# Altium schematic sheet 9-MIPI.SchDoc
size 431 x 279 mm; Organization: ORGANIZATION; Address1: ADDRESS 1; Address2: ADDRESS 2; Address3: ADDRESS 3; Address4: ADDRESS 4; DocumentNumber: 9; Revision: -; SheetNumber: 9; SheetTotal: 14; ENG_APP_DATE: --/--/--; DSN_APP_DATE: --/--/--; CHK_APP_DATE: --/--/--
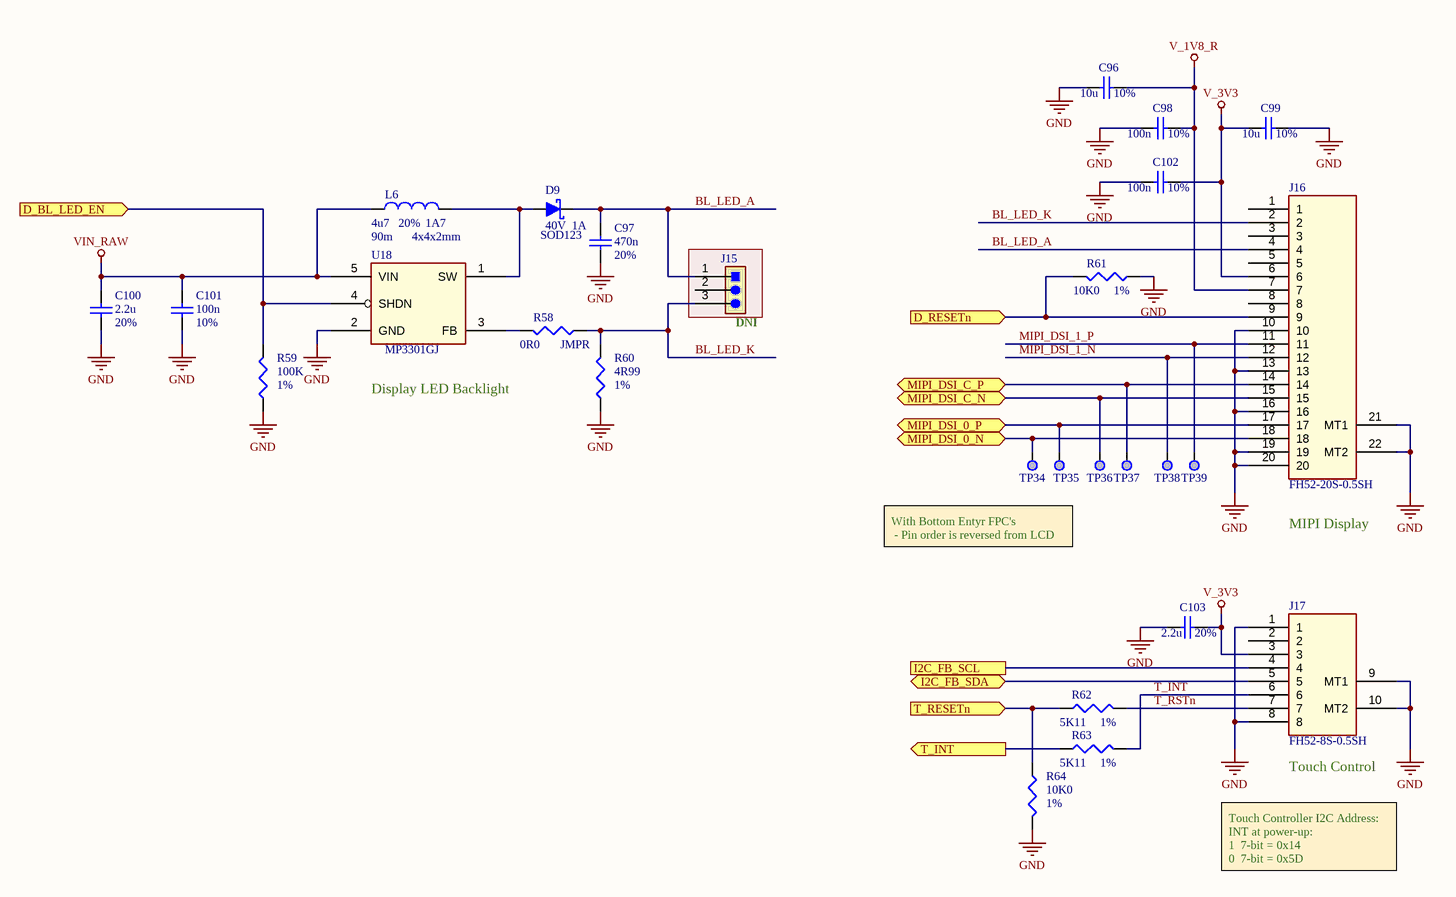
[diagram p0: 9-MIPI.SchDoc]

## Parts
C96  value 10u  Tolerance: 10%  [CAPC0402-01]  (hidden comment: Cap)
C97  value 470n  Tolerance: 20%  [CAPC0402-01]  (hidden comment: Cap)
C98  value 100n  Tolerance: 10%  [CAPC0402-01]  (hidden comment: Cap)
C99  value 10u  Tolerance: 10%  [CAPC0402-01]  (hidden comment: Cap)
C100  value 2.2u  Tolerance: 20%  [CAPC0402-01]  (hidden comment: Cap_225M25VX5R0402_1)
C101  value 100n  Tolerance: 10%  [CAPC0402-01]  (hidden comment: Cap)
C102  value 100n  Tolerance: 10%  [CAPC0402-01]  (hidden comment: Cap)
C103  value 2.2u  Tolerance: 20%  [CAPC0402-01]  (hidden comment: Cap_225M25VX5R0402_1)
D9  value 40V  1A  PackageDescription: SOD123  [SOD123F_NXP]  (hidden comment: D Schottky)
J15  TSW-103-07-G-S  [CONN_HDR_1X3_STRT_0.100_no3D]  (value not drawn)
J16  FH52-20S-0.5SH  [CONN_FPC_BOT-ENT_FRONT-LOCK_0.50_20_reversed]
J17  FH52-8S-0.5SH  [CONN_FPC_BOT-ENT_FRONT-LOCK_0.50_8_reversed]
L6  value 4u7  PackageDescription: 4x4x2mm  DCR: 90m  RMS_Current: 1A7  Tolerance: 20%  [IND_IFSC_1515AH_VIS-M]  (hidden comment: Inductor)
R58  value 0R0  Tolerance: JMPR  [RESC0402-01]  (hidden comment: Res3)
R59  value 100K  Tolerance: 1%  [RESC0402-01]  (hidden comment: Res3)
R60  value 4R99  Tolerance: 1%  [RESC0402-01]  (hidden comment: Res3)
R61  value 10K0  Tolerance: 1%  [RESC0402-01]  (hidden comment: Res3)
R62  value 5K11  Tolerance: 1%  [RESC0402-01]  (hidden comment: Res3)
R63  value 5K11  Tolerance: 1%  [RESC0402-01]  (hidden comment: Res3)
R64  value 10K0  Tolerance: 1%  [RESC0402-01]  (hidden comment: Res3)
TP34  TP_SMPAD  [TP_30_RND]  (value not drawn)  (no BOM)
TP35  TP_SMPAD  [TP_30_RND]  (value not drawn)  (no BOM)
TP36  TP_SMPAD  [TP_30_RND]  (value not drawn)  (no BOM)
TP37  TP_SMPAD  [TP_30_RND]  (value not drawn)  (no BOM)
TP38  TP_SMPAD  [TP_30_RND]  (value not drawn)  (no BOM)
TP39  TP_SMPAD  [TP_30_RND]  (value not drawn)  (no BOM)
U18  MP3301GJ  [TSOT23-5_ONS]

## Ports
D_BL_LED_EN (in), D_RESETn (in), I2C_FB_SCL, I2C_FB_SDA (bidir), MIPI_DSI_0_N (bidir), MIPI_DSI_0_P (bidir), MIPI_DSI_C_N (bidir), MIPI_DSI_C_P (bidir), T_INT (out), T_RESETn (in)

## Nets
GND: C96.2 C97.2 C98.2 C99.1 C100.1 C101.2 C102.2 C103.2 J16.10 J16.13 J16.16 J16.19 J16.20 J16.21(MT1) J16.22(MT2) J17.1 J17.8 J17.9(MT1) J17.10(MT2) R59.1 R60.1 R61.1 R64.2 U18.2(GND)
V_1V8_R: C96.1 C98.1 J16.7
V_3V3: C99.2 C102.1 C103.1 J16.6 J17.3
VIN_RAW: C100.2 C101.1 L6.1 U18.5(VIN)
BL_LED_A: C97.1 D9.1(K) J15.1 J16.4
BL_LED_K: J15.3 J16.2 R58.1 R60.2
D_BL_LED_EN: R59.2 U18.4(SHDN) ; port D_BL_LED_EN
D_RESETn: J16.9 R61.2 ; port D_RESETn
I2C_FB_SCL: J17.4 ; port I2C_FB_SCL
I2C_FB_SDA: J17.5 ; port I2C_FB_SDA
MIPI_DSI_0_N: J16.18 TP34.1 ; port MIPI_DSI_0_N
MIPI_DSI_0_P: J16.17 TP35.1 ; port MIPI_DSI_0_P
MIPI_DSI_1_N: J16.12 TP38.1
MIPI_DSI_1_P: J16.11 TP39.1
MIPI_DSI_C_N: J16.15 TP36.1 ; port MIPI_DSI_C_N
MIPI_DSI_C_P: J16.14 TP37.1 ; port MIPI_DSI_C_P
T_INT: J17.6 R63.2
T_INT: R63.1 ; port T_INT  [a separate net that carries the same name]
T_RESETn: R62.1 R64.1 ; port T_RESETn
T_RSTn: J17.7 R62.2
NetD9_2: D9.2(A) L6.2 U18.1(SW)
NetR58_2: R58.2 U18.3(FB)

Not connected (* = marked no-connect by the designer): J15 2; J16 1 3 5 8; J17 2

## Notes on the sheet
- (near J15) DNI
- Display LED Backlight
- With Bottom Entyr FPC's
  - Pin order is reversed from LCD
- (near J16) MIPI Display
- (near J17) Touch Control
- Touch Controller I2C Address:
  INT at power-up:
  1  7-bit = 0x14
  0  7-bit = 0x5D
- DWG. NO.
- REV
- SHT
- REVISION
- DESCRIPTION
- DATE
- APPROVED
- ENG:
- APPROVALS
- PROJECT
- Suite 300
- Alif Semiconductor
- 7901 Stoneridge Drive
- DSN:
- CHK:
- REFERENCE DOCUMENTS
- TITLE
- Pleasanton, CA 94588  USA
- BOM:
- FAB DWG:
- PCB DWG:
- ASSY DWG:
- SCALE:
- SIZE
- B
- CAGE CODE
- FILE NAME
- DWG NO.
- SHEET
- OF
- none

## Library data of the parts
C96 C99 = Cap: Cap,10uF,20%,10V,X5R,0402; Manufacturer 1: AVX; Manufacturer Part Number 1: 0402ZD106MAT2A; PCB_Footprint: CC0402; Published: 8-Jun-2000; LatestRevisionDate: 17-Jul-2002; LatestRevisionNote: Re-released for DXP Platform.; PackageReference: RAD-0.3; Publisher: Altium Limited; PackageDescription: Radial Cap, Thru-Hole; 2 Leads; 0.3 in Pin Spacing; Max_Height: 0.60mm; Manufacturer 2: Samsung; Manufacturer Part Number 2: CL05A106MP5NUNC; Manufacturer 3: Venkel; Manufacturer Part Number 3: C0402X5R100-106MNP; Type: X5R; Voltage: 10V
C97 = Cap: Cap,470nF,20%,50V,X5R,0402; Manufacturer 1: MuRata; Manufacturer Part Number 1: GRM155R61H474ME11D; PCB_Footprint: CC0402; Type: X7R; Published: 8-Jun-2000; LatestRevisionDate: 17-Jul-2002; LatestRevisionNote: Re-released for DXP Platform.; PackageReference: RAD-0.3; Publisher: Altium Limited; PackageDescription: Radial Cap, Thru-Hole; 2 Leads; 0.3 in Pin Spacing; Max_Height: 0.60mm; Manufacturer 2: Cal-Chip; Manufacturer Part Number 2: GMC04X5R474M50NT; Manufacturer 3: *; Manufacturer Part Number 3: *; Voltage: 50V
C98 C101 C102 = Cap: Cap,100nF,10%,50V,X7R,0402; Manufacturer 1: TDK; Manufacturer Part Number 1: C1005X7R1H104K050BE; PCB_Footprint: CC0402; Published: 8-Jun-2000; LatestRevisionDate: 17-Jul-2002; LatestRevisionNote: Re-released for DXP Platform.; PackageReference: RAD-0.3; Publisher: Altium Limited; PackageDescription: Radial Cap, Thru-Hole; 2 Leads; 0.3 in Pin Spacing; Max_Height: 0.60mm; Manufacturer 2: Samsung; Manufacturer Part Number 2: CL05B104KB54PNC; Manufacturer 3: Walsin; Manufacturer Part Number 3: 0402B104K500CT; Type: X7R; Voltage: 50V
C100 C103 = Cap_225M25VX5R0402_1: Cap,2.2uF,20%,25V,X5R,0402; Manufacturer 1: TDK; Manufacturer Part Number 1: C1005X5R1E225M050BC; PCB_Footprint: CC0402; Published: 8-Jun-2000; LatestRevisionDate: 17-Jul-2002; LatestRevisionNote: Re-released for DXP Platform.; PackageReference: RAD-0.3; Publisher: Altium Limited; PackageDescription: Radial Cap, Thru-Hole; 2 Leads; 0.3 in Pin Spacing; Max_Height: 0.60mm; Manufacturer 2: Murata; Manufacturer Part Number 2: GRM155R61E225ME11D; Manufacturer 3: Murata; Manufacturer Part Number 3: GRM155R61E225ME15D; Type: X5R; Voltage: 25V
D9 = D Schottky: Diode,Schottky,1A,40V,SOD123; Manufacturer 1: ST; Manufacturer Part Number 1: STPS140ZY; Published: 8-Jun-2000; LatestRevisionDate: 17-Jul-2002; LatestRevisionNote: Re-released for DXP Platform.; PackageReference: SOD123; Publisher: Altium Limited; Code_JEDEC: SOD123; Manufacturer 2: Panjit; Manufacturer Part Number 2: SBA140AS_R1_00001; Manufacturer 3: Nexpheria; Manufacturer Part Number 3: PMEG4010EH,115
J15 = Hdr_M_1X3_2M54_STRT_UNSHROUD: DNI,Hdr, 0.025" SQ Post Header, Through-hole, Vertical, -55 to 125 degC, 2.54 mm Pitch, 3-Pin, Male, RoHS; Manufacturer: Samtec; Pitch: 2.54 mm; ComponentLink3URL: http://www.samtec.com/documents/webfiles/cpdf/TSW-XXX-XX-XXX-X-XX-XXX-MKT.pdf; Temperature Range: -55 to 125 degC; DatasheetVersion: F-214; ComponentLink1Description: Manufacturer URL; ComponentLink2URL: http://www.samtec.com/documents/webfiles/pdf/TSW_TH.PDF; RoHS: True; Orientation: Vertical; ComponentLink2Description: Datasheet; ComponentLink3Description: Package Specification; PackageDescription: .025[0.64] SQ. Post Terminal Strip Assembly; Mounting Technology: Through-hole; PackageVersion: DM, 8/1988; ComponentLink1URL: http://www.samtec.com; PackageReference: TSW-103-07-X-S; PartNumber: TSW-103-07-G-S; Manufacturer 1: Samtec; Manufacturer Part Number 1: TSW-103-07-G-S; Manufacturer 2: Sullins; Manufacturer Part Number 2: PRPC003SAAN-RC; Manufacturer 3: 3M; Manufacturer Part Number 3: 929647-01-03-I
J16 = Conn_FFC_BOT_SLIDEorLOCK_0.50_20pin: Conn,FlatFlex,20 pin,0.50mm,bottom-entry,slide-flap,SMT; Manufacturer 1: HiRose; Copyright: Copyright (C) 2022 Ultra Librarian. All rights reserved.; Manufacturer Part Number 1: FH52-20S-0.5SH; Manufacturer 2: HiRose; Manufacturer Part Number 2: FH52-20S-0.5SH(99); Manufacturer 3: Molex; Manufacturer Part Number 3: 5051102091; RefDes: RefDes; Type: DEV
J17 = Conn_FFC_BOT_SLIDorLOCK_0.50_8pin: Conn,FlatFlex,8 pin,0.50mm,bottom-entry,slide-flap,SMT; Mfr_Name: Omron; Manufacturer 1: HiRose; Manufacturer Part Number 1: FH52E-8S-0.5SH(99); Copyright: Copyright (C) 2022 Ultra Librarian. All rights reserved.; *: *; Digi-Key_Part_Number_3: *; Digi-Key_Part_Number_4: *; RefDes: RefDes; Type: DEV; Manufacturer 2: HiRose; Manufacturer Part Number 2: FH52-8S-0.5SH(99)
L6 = Inductor: Ind,Shielded,4.7uH,20%,1.7A,900mOhm,4x4x2mm; Manufacturer 1: Vishay; Manufacturer Part Number 1: IFSC1515AHER4R7M01; Published: 8-Jun-2000; LatestRevisionDate: 29-May-2009; LatestRevisionNote: IPC-7351 Footprint Added.; PackageReference: 4x4x2mm; Publisher: Altium Limited; Code_JEITA: 4x4x2mm; Code_IEC: 4x4x2mm; Sat_Current: *; Impedance: *; Type: *; Manufacturer 2: Yageo; Manufacturer Part Number 2: BWVS004040184R7M00; Manufacturer 3: Abracon; Manufacturer Part Number 3: ASPI-0418FS-4R7-T3; Max_Height: 0.60mm; PCB_Footprint: 4x4x2mm
R58 = Res3: Res,0R ohm,Jumper,0402; Manufacturer 1: Stackpol; Manufacturer Part Number 1: RMCF0402ZT0R00; Wattage: 63mW; Published: 8-Jun-2000; LatestRevisionDate: 29-May-2009; LatestRevisionNote: IPC-7351 Footprint Added.; PackageReference: RESC0402-01; Publisher: Altium Limited; PackageDescription: Chip Resistor; Voltage: *; Type: Thick Film; Manufacturer 2: Yageo; Manufacturer Part Number 2: RC0402FR-070RL; Manufacturer 3: Panasonic; Manufacturer Part Number 3: ERJ-XGN0R00Y; PCB_Footprint: RESC0402-01
R59 = Res3: Res,100K,1%,100ppm,0402; Manufacturer 1: Stackpol; Manufacturer Part Number 1: RMCF0402FT100K; Wattage: 63mW; Published: 8-Jun-2000; LatestRevisionDate: 29-May-2009; LatestRevisionNote: IPC-7351 Footprint Added.; PackageReference: RESC0402-01; Publisher: Altium Limited; PackageDescription: Chip Resistor; Voltage: *; Type: Thick Film; Manufacturer 2: Yageo; Manufacturer Part Number 2: RC0402FR-07100KL; Manufacturer 3: Bourns; Manufacturer Part Number 3: CR0402-FX-1003GLF; PCB_Footprint: RESC0402-01
R60 = Res3: Res,4R99,1%,100ppm,0402; Manufacturer 1: Vishay; Manufacturer Part Number 1: CRCW04024R99FKED; Wattage: 50mW; Published: 8-Jun-2000; LatestRevisionDate: 29-May-2009; LatestRevisionNote: IPC-7351 Footprint Added.; PackageReference: RESC0402-01; Publisher: Altium Limited; PackageDescription: Chip Resistor; Voltage: *; Type: Thick Film; Manufacturer 2: Vishay; Manufacturer Part Number 2: CRCW04024R99FKEDHP; PCB_Footprint: RESC0402-01
R61 R64 = Res3: Res,10K0,1%,100ppm,0402; Manufacturer 1: Stackpol; Manufacturer Part Number 1: RMCF0402FT10K0; Wattage: 63mW; Published: 8-Jun-2000; LatestRevisionDate: 29-May-2009; LatestRevisionNote: IPC-7351 Footprint Added.; PackageReference: RESC0402-01; Publisher: Altium Limited; PackageDescription: Chip Resistor; Voltage: *; Type: Thick Film; Manufacturer 2: Yageo; Manufacturer Part Number 2: RC0402FR-0710KL; Manufacturer 3: Bourns; Manufacturer Part Number 3: CR0402-FX-1002GLF; PCB_Footprint: RESC0402-01
R62 R63 = Res3: Res,5K11,1%,100ppm,0402; Manufacturer 1: KOA; Manufacturer Part Number 1: RK73H1ETTP5111F; Wattage: 63mW; Published: 8-Jun-2000; LatestRevisionDate: 29-May-2009; LatestRevisionNote: IPC-7351 Footprint Added.; PackageReference: RESC0402-01; Publisher: Altium Limited; PackageDescription: Chip Resistor; Voltage: *; Type: Thick Film; Manufacturer 2: Yageo; Manufacturer Part Number 2: RC0402FR-075K11L; Manufacturer 3: Bourns; Manufacturer Part Number 3: CR0402-FX-5111GLF; PCB_Footprint: RESC0402-01
TP34-TP39 = TP_SMPAD: Test Point, SMT Pad,--not a BOM item--; PCB_Footprint: TP_PAD1
U18 = IC_BOOST_CAT4139TD-GT3: IC, Boost Converter, LED Driver; Manufacturer 1: MPS; Manufacturer Part Number 1: MP3301GJ; Manufacturer 2: *; Manufacturer Part Number 2: *